# Altium schematic sheet ECS.SchDoc
size A4
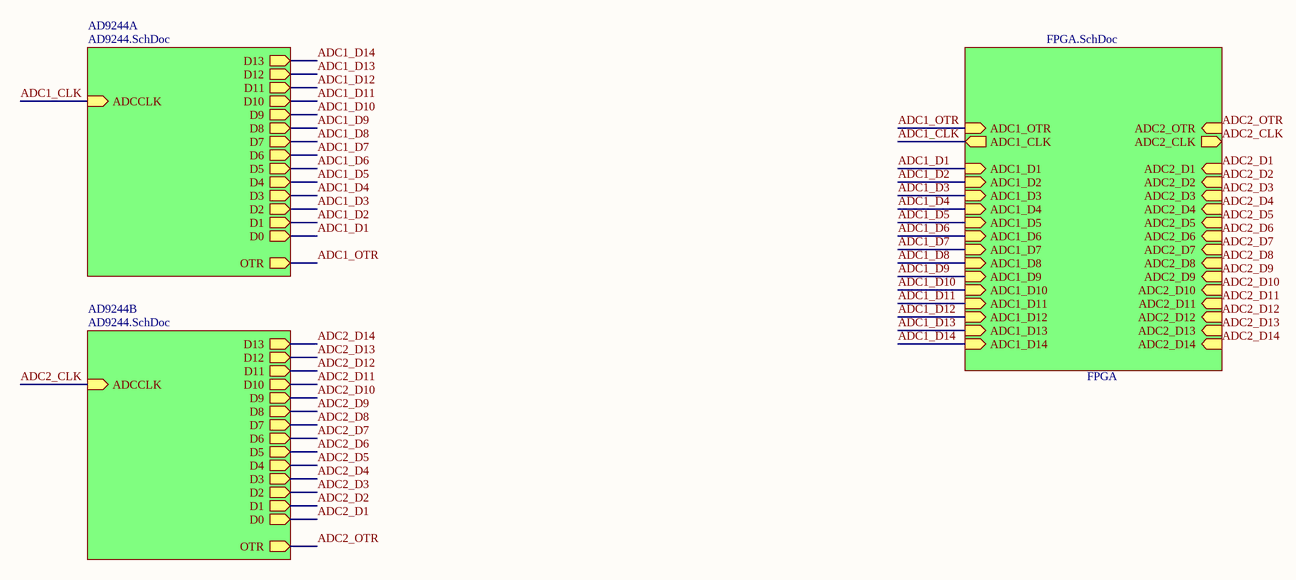
[diagram p0: ECS.SchDoc]

## Sub-sheets
AD9244A = AD9244.SchDoc: D13 (out), D12 (out), D11 (out), D10 (out), D9 (out), D8 (out), D7 (out), D6 (out), D4 (out), D5 (out), D3 (out), D2 (out), D1 (out), D0 (out), OTR (out), ADCCLK (in)
AD9244B = AD9244.SchDoc: D13 (out), D12 (out), D11 (out), D10 (out), D9 (out), D8 (out), D7 (out), D6 (out), D4 (out), D5 (out), D3 (out), D2 (out), D1 (out), D0 (out), OTR (out), ADCCLK (in)
FPGA = FPGA.SchDoc: ADC1_OTR (in), ADC1_D1 (in), ADC1_D2 (in), ADC1_D3 (in), ADC1_D4 (in), ADC1_D5 (in), ADC1_D6 (in), ADC1_D7 (in), ADC1_D8 (in), ADC1_D9 (in), ADC1_D10 (in), ADC1_D11 (in), ADC1_D12 (in), ADC1_D13 (in), ADC1_D14 (in), ADC1_CLK (out), ADC2_CLK (out), ADC2_OTR (in), ADC2_D1 (in), ADC2_D2 (in), ADC2_D3 (in), ADC2_D4 (in), ADC2_D5 (in), ADC2_D6 (in), ADC2_D7 (in), ADC2_D8 (in), ADC2_D9 (in), ADC2_D10 (in), ADC2_D11 (in), ADC2_D12 (in), ADC2_D13 (in), ADC2_D14 (in)

## Nets
ADC1_CLK: sheet FPGA/ADC1_CLK, sheet AD9244A/ADCCLK
ADC1_D1: sheet FPGA/ADC1_D1, sheet AD9244A/D0
ADC1_D2: sheet FPGA/ADC1_D2, sheet AD9244A/D1
ADC1_D3: sheet FPGA/ADC1_D3, sheet AD9244A/D2
ADC1_D4: sheet FPGA/ADC1_D4, sheet AD9244A/D3
ADC1_D5: sheet FPGA/ADC1_D5, sheet AD9244A/D4
ADC1_D6: sheet FPGA/ADC1_D6, sheet AD9244A/D5
ADC1_D7: sheet FPGA/ADC1_D7, sheet AD9244A/D6
ADC1_D8: sheet FPGA/ADC1_D8, sheet AD9244A/D7
ADC1_D9: sheet FPGA/ADC1_D9, sheet AD9244A/D8
ADC1_D10: sheet FPGA/ADC1_D10, sheet AD9244A/D9
ADC1_D11: sheet FPGA/ADC1_D11, sheet AD9244A/D10
ADC1_D12: sheet FPGA/ADC1_D12, sheet AD9244A/D11
ADC1_D13: sheet FPGA/ADC1_D13, sheet AD9244A/D12
ADC1_D14: sheet FPGA/ADC1_D14, sheet AD9244A/D13
ADC1_OTR: sheet FPGA/ADC1_OTR, sheet AD9244A/OTR
ADC2_CLK: sheet FPGA/ADC2_CLK, sheet AD9244B/ADCCLK
ADC2_D1: sheet FPGA/ADC2_D1, sheet AD9244B/D0
ADC2_D2: sheet FPGA/ADC2_D2, sheet AD9244B/D1
ADC2_D3: sheet FPGA/ADC2_D3, sheet AD9244B/D2
ADC2_D4: sheet FPGA/ADC2_D4, sheet AD9244B/D3
ADC2_D5: sheet FPGA/ADC2_D5, sheet AD9244B/D4
ADC2_D6: sheet FPGA/ADC2_D6, sheet AD9244B/D5
ADC2_D7: sheet FPGA/ADC2_D7, sheet AD9244B/D6
ADC2_D8: sheet FPGA/ADC2_D8, sheet AD9244B/D7
ADC2_D9: sheet FPGA/ADC2_D9, sheet AD9244B/D8
ADC2_D10: sheet FPGA/ADC2_D10, sheet AD9244B/D9
ADC2_D11: sheet FPGA/ADC2_D11, sheet AD9244B/D10
ADC2_D12: sheet FPGA/ADC2_D12, sheet AD9244B/D11
ADC2_D13: sheet FPGA/ADC2_D13, sheet AD9244B/D12
ADC2_D14: sheet FPGA/ADC2_D14, sheet AD9244B/D13
ADC2_OTR: sheet FPGA/ADC2_OTR, sheet AD9244B/OTR